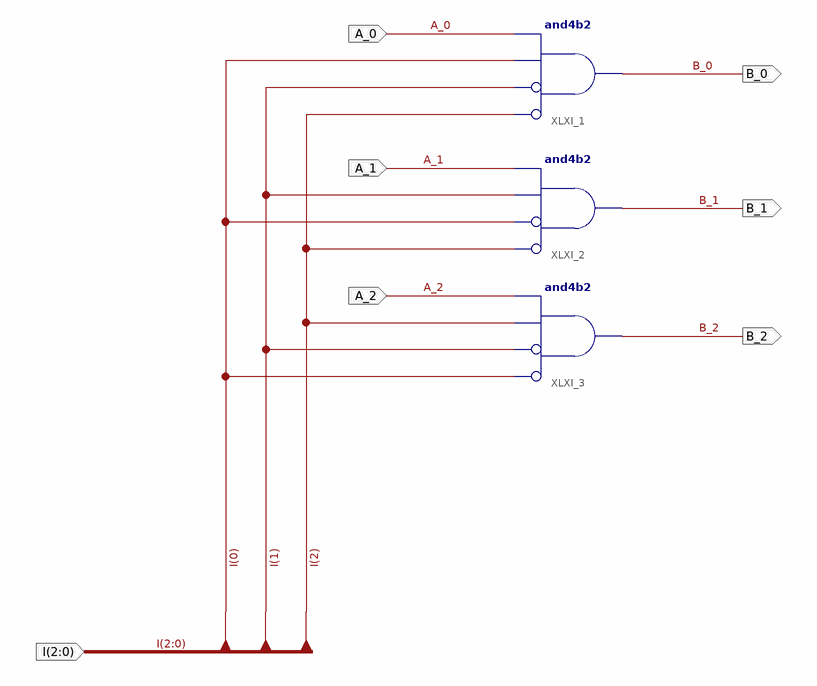
[diagram p0: schematic sheet 1]
// Xilinx ISE schematic MUX_3_TO_1.sch (spartan3e) as structural Verilog: 3 symbols, 7 ports
module MUX_3_TO_1 (
  input  A_0,
  input  A_1,
  input  A_2,
  input  [2:0] I,
  output B_0,
  output B_1,
  output B_2
);

  and XLXI_1 (B_0, ~I[2], ~I[1], I[0], A_0);  // and4b2
  and XLXI_2 (B_1, ~I[2], ~I[0], I[1], A_1);  // and4b2
  and XLXI_3 (B_2, ~I[0], ~I[1], I[2], A_2);  // and4b2
endmodule
